# Altium schematic sheet Interface connector.SchDoc
size A4; CompanyName: Technische Hochschule Nürnberg Georg Simon Ohm; Organization: UltraZohm; Address1: Kesslerplatz 12; Address2: 90489 Nürnberg; Address3: GERMANY; DocumentNumber: 9; SheetNumber: 9; SheetTotal: 12; Website: www.ultrazohm.com
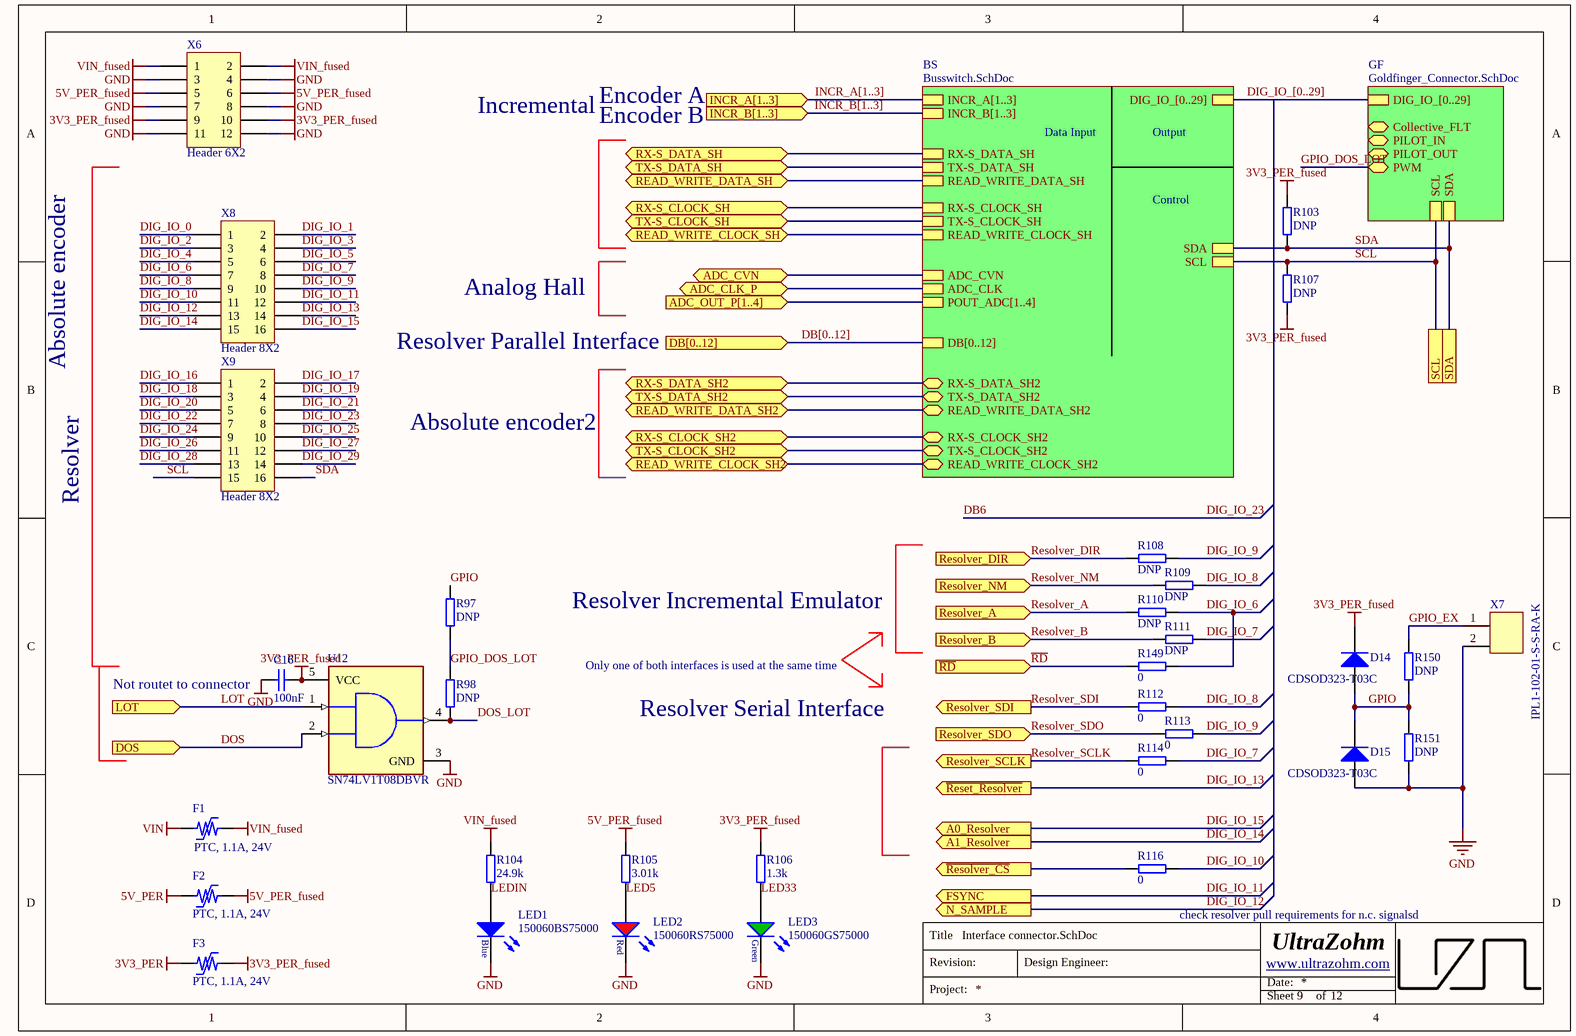
[diagram p0: Interface connector.SchDoc]

## Parts
C16  100nF  [CAPC1608X07N]
D14  CDSOD323-T03C  [SOD-323]
D15  CDSOD323-T03C  [SOD-323]
F1  PTC, 1.1A, 24V  [1812_PTC_Polyfuse_Littelfuse]
F2  PTC, 1.1A, 24V  [1812_PTC_Polyfuse_Littelfuse]
F3  PTC, 1.1A, 24V  [1812_PTC_Polyfuse_Littelfuse]
LED1  150060BS75000  [WL-SMCW_0603]
LED2  150060RS75000  [WL-SMCW_0603]
LED3  150060GS75000  [WL-SMCW_0603]
R97  DNP  [RESC1608X06N]
R98  DNP  [RESC1608X06N]
R103  DNP  [RESC1608X06N]
R104  24.9k  [RESC1608X06N]
R105  3.01k  [RESC1608X06N]
R106  1.3k  [RESC1608X06N]
R107  DNP  [RESC1608X06N]
R108  DNP  [RESC1608X06N]
R109  DNP  [RESC1608X06N]
R110  DNP  [RESC1608X06N]
R111  DNP  [RESC1608X06N]
R112  0  [RESC1608X06N]
R113  0  [RESC1608X06N]
R114  0  [RESC1608X06N]
R116  0  [RESC1608X06N]
R149  0  [RESC1608X06N]
R150  DNP  [RESC1608X06N]
R151  DNP  [RESC1608X06N]
U12  SN74LV1T08DBVR  [FP-DBV0005A-IPC_B]
X6  Header 6X2  [HDR2X6]
X7  IPL1-102-01-S-S-RA-K  [Conector 1x2 TH Horizontal]
X8  Header 8X2  [HDR2X8]
X9  Header 8X2  [HDR2X8]

## Sub-sheets
BS = Busswitch.SchDoc: TX-S_DATA_SH, READ_WRITE_DATA_SH, INCR_B[1..3], POUT_ADC[1..4], ADC_CLK, RX-S_CLOCK_SH, INCR_A[1..3], RX-S_DATA_SH, ADC_CVN, TX-S_CLOCK_SH, DB[0..12], READ_WRITE_CLOCK_SH, DIG_IO_[0..29], TX-S_CLOCK_SH2 (bidir), RX-S_CLOCK_SH2 (bidir), RX-S_DATA_SH2 (bidir), READ_WRITE_DATA_SH2 (bidir), READ_WRITE_CLOCK_SH2 (bidir), TX-S_DATA_SH2 (bidir), SDA, SCL
GF = Goldfinger_Connector.SchDoc: Collective_FLT (bidir), PILOT_IN (bidir), PILOT_OUT (bidir), PWM (bidir), DIG_IO_[0..29], SDA, SCL

## Ports
A0_Resolver (out), A1_Resolver (out), ADC_CLK_P (bidir), ADC_CVN (bidir), ADC_OUT_P[1..4] (in), DB[0..12] (in), DOS (in), FSYNC (out), INCR_A[1..3] (in), INCR_B[1..3] (in), LOT (in), N_SAMPLE (out), READ_WRITE_CLOCK_SH2 (bidir), READ_WRITE_CLOCK_SH (bidir), READ_WRITE_DATA_SH2 (bidir), READ_WRITE_DATA_SH (bidir), Resolver_A (in), Resolver_B (in), Resolver_DIR (in), Resolver_NM (in), Resolver_SCLK (out), Resolver_SDI (out), Resolver_SDO (in), RX-S_CLOCK_SH2 (bidir), RX-S_CLOCK_SH (bidir), RX-S_DATA_SH2 (bidir), RX-S_DATA_SH (bidir), SCL, SDA, TX-S_CLOCK_SH2 (bidir), TX-S_CLOCK_SH (bidir), TX-S_DATA_SH2 (bidir), TX-S_DATA_SH (bidir), ~{RD} (in), ~{Reset_Resolver} (out), ~{Resolver_CS} (out)

## Nets
3V3_PER: F3.1
3V3_PER_fused: C16.2 D14.1(K) F3.2 R103.1 R106.2 R107.2 U12.5(VCC) X6.9 X6.10
5V_PER: F2.1
5V_PER_fused: F2.2 R105.2 X6.5 X6.6
GND: C16.1 D15.2(A) LED1.1(K) LED2.1(K) LED3.1(K) R151.2 U12.3(GND) X6.3 X6.4 X6.7 X6.8 X6.11 X6.12 X7.2
VIN: F1.1
VIN_fused: F1.2 R104.2 X6.1 X6.2
~{RD}: R149.2 ; port ~{RD}
~{Resolver_CS}: R116.2 ; port ~{Resolver_CS}
ADC_CLK_P: port ADC_CLK_P, sheet BS/ADC_CLK
ADC_CVN: port ADC_CVN, sheet BS/ADC_CVN
DB6: X9.8  [also labelled DIG_IO_23]
DIG_IO_0: X8.1
DIG_IO_1: X8.2
DIG_IO_2: X8.3
DIG_IO_3: X8.4
DIG_IO_4: X8.5
DIG_IO_5: X8.6
DIG_IO_6: R110.1 R149.1 X8.7
DIG_IO_7: R111.1 R114.1 X8.8
DIG_IO_8: R109.1 R112.1 X8.9
DIG_IO_9: R108.1 R113.1 X8.10
DIG_IO_10: R116.1 X8.11
DIG_IO_11: X8.12 ; port FSYNC
DIG_IO_12: X8.13 ; port N_SAMPLE
DIG_IO_13: X8.14 ; port ~{Reset_Resolver}
DIG_IO_14: X8.15 ; port A1_Resolver
DIG_IO_15: X8.16 ; port A0_Resolver
DIG_IO_16: X9.1
DIG_IO_17: X9.2
DIG_IO_18: X9.3
DIG_IO_19: X9.4
DIG_IO_20: X9.5
DIG_IO_21: X9.6
DIG_IO_22: X9.7
DIG_IO_24: X9.9
DIG_IO_25: X9.10
DIG_IO_26: X9.11
DIG_IO_27: X9.12
DIG_IO_28: X9.13
DIG_IO_29: X9.14
DOS: U12.2(B) ; port DOS
DOS_LOT: R98.2 U12.4(Y)
GPIO: D14.2(A) D15.1(K) R97.1 R150.2 R151.1
GPIO_DOS_LOT: R97.2 R98.1 ; sheet GF/PWM
GPIO_EX: R150.1 X7.1
LED5: LED2.2(A) R105.1
LED33: LED3.2(A) R106.1
LEDIN: LED1.2(A) R104.1
LOT: U12.1(A) ; port LOT
READ_WRITE_CLOCK_SH: port READ_WRITE_CLOCK_SH, sheet BS/READ_WRITE_CLOCK_SH
READ_WRITE_CLOCK_SH2: port READ_WRITE_CLOCK_SH2, sheet BS/READ_WRITE_CLOCK_SH2
READ_WRITE_DATA_SH: port READ_WRITE_DATA_SH, sheet BS/READ_WRITE_DATA_SH
READ_WRITE_DATA_SH2: port READ_WRITE_DATA_SH2, sheet BS/READ_WRITE_DATA_SH2
Resolver_A: R110.2 ; port Resolver_A
Resolver_B: R111.2 ; port Resolver_B
Resolver_DIR: R108.2 ; port Resolver_DIR
Resolver_NM: R109.2 ; port Resolver_NM
Resolver_SCLK: R114.2 ; port Resolver_SCLK
Resolver_SDI: R112.2 ; port Resolver_SDI
Resolver_SDO: R113.2 ; port Resolver_SDO
RX-S_CLOCK_SH: port RX-S_CLOCK_SH, sheet BS/RX-S_CLOCK_SH
RX-S_CLOCK_SH2: port RX-S_CLOCK_SH2, sheet BS/RX-S_CLOCK_SH2
RX-S_DATA_SH: port RX-S_DATA_SH, sheet BS/RX-S_DATA_SH
RX-S_DATA_SH2: port RX-S_DATA_SH2, sheet BS/RX-S_DATA_SH2
SCL: R107.1 X9.15 ; port SCL, sheet GF/SCL, sheet BS/SCL
SDA: R103.2 X9.16 ; port SDA, sheet GF/SDA, sheet BS/SDA
TX-S_CLOCK_SH: port TX-S_CLOCK_SH, sheet BS/TX-S_CLOCK_SH
TX-S_CLOCK_SH2: port TX-S_CLOCK_SH2, sheet BS/TX-S_CLOCK_SH2
TX-S_DATA_SH: port TX-S_DATA_SH, sheet BS/TX-S_DATA_SH
TX-S_DATA_SH2: port TX-S_DATA_SH2, sheet BS/TX-S_DATA_SH2

## Buses and harness runs
bus DB[0..12] = port DB[0..12] = sheet BS/DB[0..12]
bus DIG_IO_[0..29] = sheet BS/DIG_IO_[0..29] = sheet GF/DIG_IO_[0..29]
bus INCR_A[1..3] = port INCR_A[1..3] = sheet BS/INCR_A[1..3]
bus INCR_B[1..3] = port INCR_B[1..3] = sheet BS/INCR_B[1..3]
bus port ADC_OUT_P[1..4] = sheet BS/POUT_ADC[1..4]

## Notes on the sheet
- Incremental
- Encoder A
- Encoder B
- Data Input
- Output
- Control
- Analog Hall
- Absolute encoder
- Resolver Parallel Interface
- Absolute encoder2
- Resolver
- Resolver Incremental Emulator
- (near C16) Not routet to connector
- Only one of both interfaces is used at the same time
- Resolver Serial Interface
- (near R116) check resolver pull requirements for n.c. signalsd
- Title
- Revision:
- Design Engineer:
- Date:
- Project:
- Sheet
- of

## Library data of the parts
C16 = Cap_0603: MPN: 885012206071; MF: Würth; Voltage: 25V; Value: 100nF; Supplier 1: Mouser; Supplier 2: *; Supplier Part Number 1: 710-885012206071; Supplier Part Number 2: *
D14 D15 = Diodo TVS: TVS DIODE 3.3V 19V SOD323; MF: Bourns; Supplier Part Number 2: CDSOD323-T03CCT-ND; MPN: CDSOD323-T03C; Supplier Part Number 1: 652-CDSOD323-T03C; Package: SOD-323-2; Supplier 2: Digi-Key; Supplier 1: Mouser
F1-F3 = Littelfuse_PTC_1812: Resettable PTC Polyfuse SMD, 1812, automotive; MPN: miniASMDC110F/24; Trip Current: 2.2A; Resistance: 0.18Ohm; MF: Littelfuse; Created: 2019_02_10_AGeiger; Package: 1812; ComponentLink1URL: https://www.littelfuse.com/~/media/electronics/datasheets/resettable_ptcs/littelfuse_ptc_surface_mount_catalog_datasheet.pdf.pdf; ComponentLink1Description: Datasheet; Value: PTC, 1.1A, 24V; Voltage: 24V; Hold Current: 1.1A
LED1 = LED_Blue_0603: WL-SMCW SMD Mono-color Chip LED Waterclear, size 0603, Blue, 3.2 V, 140°; Forward Voltage: 3.2 V; Luminous Intensity: 145 mcd; Peak Wavelength: 465 nm; Dominant Wavelength: 470 nm; MF: Wuerth Elektronik; Published Date: Sep. 2017; ComponentLink1Description: Manufacturer; ComponentLink1URL: http://www.we-online.de; ComponentLink2Description: Datasheet; ComponentLink2URL: http://katalog.we-online.com/led/datasheet/150060BS75000.pdf; MPN: 150060BS75000; Size: 0603; Viewing Angle: 140°; Emitting Color: Blue; Value: 150060BS75000; Package: 0603; Created: 2018_09_06_AGeiger; Supplier 1: Farnell; Supplier Part Number 1: 2322069; Supplier 2: Mouser; Supplier Part Number 2: 710-150060BS75000; Supplier 3: Digi-Key; Supplier Part Number 3: 732-4966-1-ND
LED2 = LED_Red_0603: WL-SMCW SMD Mono-color Chip LED Waterclear, size 0603, Red, 2 V, 140°; Forward Voltage: 2 V; Luminous Intensity: 250 mcd; Peak Wavelength: 630 nm; Dominant Wavelength: 625 nm; MF: Wuerth Elektronik; Published Date: Sep. 2017; ComponentLink1Description: Manufacturer; ComponentLink1URL: http://www.we-online.de; ComponentLink2Description: Datasheet; ComponentLink2URL: http://katalog.we-online.com/led/datasheet/150060RS75000.pdf; MPN: 150060RS75000; Size: 0603; Viewing Angle: 140°; Emitting Color: Red; Value: 150060RS75000; Package: 0603; Created: 2018_09_06_AGeiger; Supplier 1: Farnell; Supplier Part Number 1: 2322071; Supplier 2: Mouser; Supplier Part Number 2: 710-150060RS75000; Supplier 3: Digi-Key; Supplier Part Number 3: 732-4978-1-ND
LED3 = LED_Green_0603: WL-SMCW SMD Mono-color Chip LED Waterclear, size 0603, Green, 3.2 V, 140°; Forward Voltage: 3.2 V; Luminous Intensity: 430 mcd; Peak Wavelength: 515 nm; Dominant Wavelength: 520 nm; MF: Wuerth Elektronik; Published Date: Sep. 2017; ComponentLink1Description: Manufacturer; ComponentLink1URL: http://www.we-online.de; ComponentLink2Description: Datasheet; ComponentLink2URL: http://katalog.we-online.com/led/datasheet/150060GS75000.pdf; MPN: 150060GS75000; Size: 0603; Viewing Angle: 140°; Emitting Color: Green; Value: 150060GS75000; Package: 0603; Created: 2018_09_06_AGeiger; Supplier 1: Farnell; Supplier Part Number 1: 2322070; Supplier 2: Mouser; Supplier Part Number 2: 710-150060GS75000; Supplier 3: Digi-Key; Supplier Part Number 3: 732-4971-1-ND
R97 R98 R150 R151 = R_0603: Value: DNP; MF: *; MPN: *; Supplier 1: *; Supplier Part Number 1: *
R103-R114 R116 = R_0603: MPN: CRCW060324K9FKEAC; MF: Vishay / Dale; Supplier 1: Mouser; Supplier Part Number 1: 71-CRCW060324K9FKEAC; Package: 0603
  R103 R107-R111: Value: DNP
  R104: Value: 24.9k
  R105: Value: 3.01k
  R106: Value: 1.3k
  R112-R114 R116: Value: 0
R149 = R_0603: MPN: CRCW060324K9FKEAC; Value: DNP; MF: Vishay / Dale; Supplier 1: Mouser; Supplier Part Number 1: 71-CRCW060324K9FKEAC; Package: 0603
U12 = CMP-0859-00119-4: IC GATE AND 1CH 2-INP SOT23-5; Quiescent Current: 1uA; Logic Function: AND GATE; Number of Inputs: 2; Number of Circuits: 1; Min Supply Voltage: 1.6V; High Level Output Current: -8mA; Max Supply Voltage: 5.5V; Low Level Output Current: 8mA; Propagation Delay: 7ns; Packaging: Tape and Reel; Number of Pins: 5; Min Operating Temperature: -40°C; Radiation Hardening: No; Package Quantity: 3000; Weight: 0.000557oz; Height: 1.45mm; RoHS Compliant: Yes; Length: 3.05mm; Number of Bits: 1; Width: 1.75mm; Number of Gates: 1; Max Operating Temperature: 125°C; Mount: Surface Mount; Case/Package: SOT-23-5; Lead Free: Lead Free; Number of Input Lines: 2
X6 = Header 6X2: Header, 6-Pin, Dual row; LatestRevisionDate: 17-Jul-2002; LatestRevisionNote: Re-released for DXP Platform.; Publisher: Altium Limited
X7 = Conector 1x2 Horizontal: CONN HEADER R/A 2POS 2.54MM Through Hole; MF: Samtec; Supplier Part Number 2: SAM12667-ND; MPN: IPL1-102-01-S-S-RA-K; Supplier Part Number 1: 200-IPL110201SSRAK; Supplier 1: Mouser; Supplier 2: Digi-Key
X8 X9 = Header 8X2: Header, 8-Pin, Dual row; LatestRevisionDate: 17-Jul-2002; LatestRevisionNote: Re-released for DXP Platform.; Publisher: Altium Limited